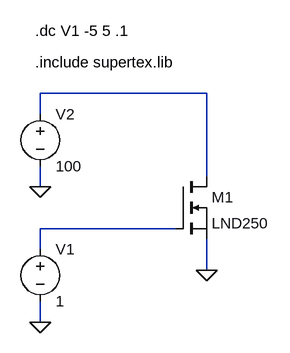
[diagram p0: schematic LND250_test.asc]
LND250_test.asc, the LTspice schematic file:
Version 4
SHEET 1 880 680
WIRE 192 -16 -64 -16
WIRE -64 16 -64 -16
WIRE 192 112 192 -16
WIRE -64 128 -64 96
WIRE 144 192 -64 192
WIRE -64 224 -64 192
WIRE 192 256 192 208
WIRE -64 336 -64 304
FLAG -64 128 0
FLAG -64 336 0
FLAG 192 256 0
SYMBOL nmos 144 112 R0
SYMATTR InstName M1
SYMATTR Value LND250
SYMBOL voltage -64 208 R0
SYMATTR InstName V1
SYMATTR Value 1
SYMBOL voltage -64 0 R0
SYMATTR InstName V2
SYMATTR Value 100
TEXT -72 -112 Left 0 !.dc V1 -5 5 .1
TEXT -72 -64 Left 0 !.include supertex.lib

The netlist it stands for:
* LND250_test.asc
M1 N001 N002 0 0 LND250
V1 N002 0 1
V2 N001 0 100
.model NMOS NMOS
.model PMOS PMOS
.lib standard.mos
.dc V1 -5 5 .1
.include supertex.lib
.backanno
.end